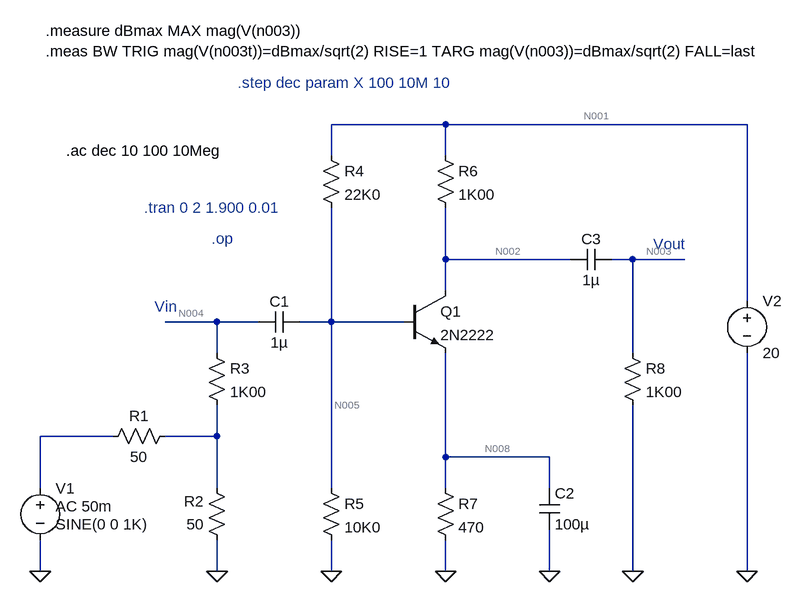
[diagram p0: schematic last ex.asc]
last ex.asc, the LTspice schematic file:
Version 4
SHEET 1 1496 680
WIRE 672 -464 496 -464
WIRE 1136 -464 672 -464
WIRE 496 -416 496 -464
WIRE 672 -416 672 -464
WIRE 672 -256 672 -336
WIRE 864 -256 672 -256
WIRE 960 -256 928 -256
WIRE 1040 -256 960 -256
WIRE 672 -208 672 -256
WIRE 1136 -192 1136 -464
WIRE 320 -160 240 -160
WIRE 384 -160 320 -160
WIRE 496 -160 496 -336
WIRE 496 -160 448 -160
WIRE 608 -160 496 -160
WIRE 320 -112 320 -160
WIRE 960 -112 960 -256
WIRE 160 16 48 16
WIRE 320 16 320 -32
WIRE 320 16 240 16
WIRE 672 48 672 -112
WIRE 832 48 672 48
WIRE 48 96 48 16
WIRE 320 96 320 16
WIRE 496 96 496 -160
WIRE 672 96 672 48
WIRE 832 96 832 48
WIRE 48 224 48 176
WIRE 320 224 320 176
WIRE 496 224 496 176
WIRE 672 224 672 176
WIRE 832 224 832 160
WIRE 960 224 960 -32
WIRE 1136 224 1136 -112
FLAG 48 224 0
FLAG 320 224 0
FLAG 496 224 0
FLAG 672 224 0
FLAG 832 224 0
FLAG 960 224 0
FLAG 1136 224 0
SYMBOL voltage 48 80 R0
WINDOW 123 24 44 Left 2
WINDOW 39 0 0 Left 0
WINDOW 3 24 72 Left 2
SYMATTR Value2 AC 50m
SYMATTR InstName V1
SYMATTR Value SINE(0 0 1K)
SYMBOL res 256 0 R90
WINDOW 0 0 56 VBottom 2
WINDOW 3 32 56 VTop 2
SYMATTR InstName R1
SYMATTR Value 50
SYMBOL res 336 192 R180
WINDOW 0 36 76 Left 2
WINDOW 3 36 40 Left 2
SYMATTR InstName R2
SYMATTR Value 50
SYMBOL res 304 -128 R0
SYMATTR InstName R3
SYMATTR Value 1K00
SYMBOL cap 448 -176 R90
WINDOW 0 0 32 VBottom 2
WINDOW 3 32 32 VTop 2
SYMATTR InstName C1
SYMATTR Value 1µ
SYMBOL res 480 -432 R0
SYMATTR InstName R4
SYMATTR Value 22K0
SYMBOL res 480 80 R0
SYMATTR InstName R5
SYMATTR Value 10K0
SYMBOL res 656 -432 R0
SYMATTR InstName R6
SYMATTR Value 1K00
SYMBOL npn 608 -208 R0
SYMATTR InstName Q1
SYMATTR Value 2N2222
SYMBOL res 656 80 R0
SYMATTR InstName R7
SYMATTR Value 470
SYMBOL cap 816 96 R0
SYMATTR InstName C2
SYMATTR Value 100µ
SYMBOL cap 928 -272 R90
WINDOW 0 0 32 VBottom 2
WINDOW 3 32 32 VTop 2
SYMATTR InstName C3
SYMATTR Value 1µ
SYMBOL res 944 -128 R0
SYMATTR InstName R8
SYMATTR Value 1K00
SYMBOL voltage 1136 -208 R0
WINDOW 123 0 0 Left 0
WINDOW 39 0 0 Left 0
SYMATTR InstName V2
SYMATTR Value 20
TEXT 224 -184 Left 2 ;Vin
TEXT 992 -280 Left 2 ;Vout
TEXT 312 -288 Left 2 ;.op
TEXT 208 -336 Left 2 ;.tran 0 2 1.900 0.01
TEXT 352 -528 Left 2 ;.step dec param X 100 10M 10
TEXT 88 -424 Left 2 !.ac dec 10 100 10Meg
TEXT 56 -608 Left 2 !.measure dBmax MAX mag(V(n003))\n.meas BW TRIG mag(V(n003t))=dBmax/sqrt(2) RISE=1 TARG mag(V(n003))=dBmax/sqrt(2) FALL=last

The netlist it stands for:
* last ex.asc
V1 N006 0 SINE(0 0 1K) AC 50m
R1 N007 N006 50
R2 0 N007 50
R3 N004 N007 1K00
C1 N005 N004 1µ
R4 N001 N005 22K0
R5 N005 0 10K0
R6 N001 N002 1K00
Q1 N002 N005 N008 0 2N2222
R7 N008 0 470
C2 N008 0 100µ
C3 N003 N002 1µ
R8 N003 0 1K00
V2 N001 0 20
.model NPN NPN
.model PNP PNP
.lib standard.bjt
* Vin
* Vout
* .op
* .tran 0 2 1.900 0.01
* .step dec param X 100 10M 10
.ac dec 10 100 10Meg
.measure dBmax MAX mag(V(n003))
.meas BW TRIG mag(V(n003t))=dBmax/sqrt(2) RISE=1 TARG mag(V(n003))=dBmax/sqrt(2) FALL=last
.backanno
.end

* Results of the author's LTspice run, read from the files saved beside the schematic
* Operating Point, zero values left out:
*   V(n005) = 5.874 V
*   V(n001) = 20 V
*   V(n002) = 9.089 V
*   V(n008) = 5.154 V
*   Ic(Q1) = 10.91 mA
*   Ib(Q1) = 54.72 µA
*   Ie(Q1) = -10.97 mA
*   I(R4) = 642.1 µA
*   I(R5) = 587.4 µA
*   I(R6) = 10.91 mA
*   I(R7) = 10.97 mA
*   I(V2) = -11.55 mA
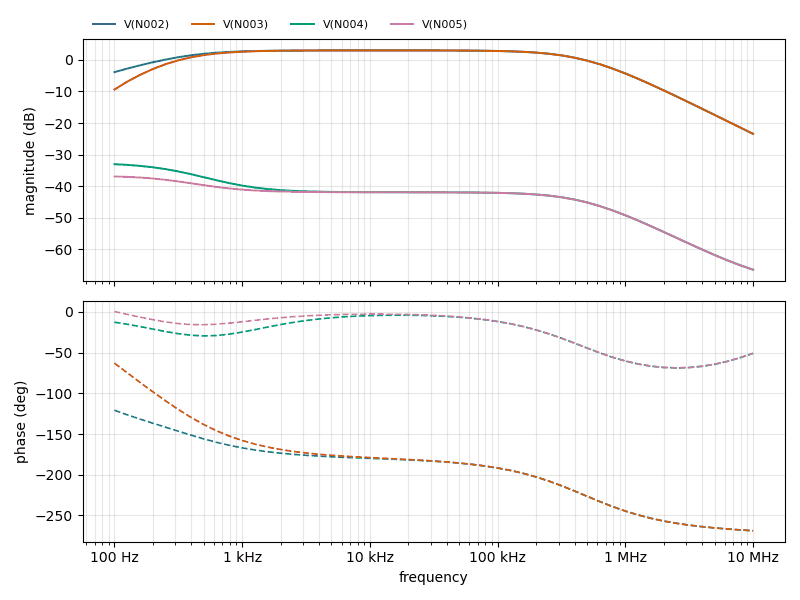
[diagram p1: AC Analysis of last ex.asc, plotted from the saved traces]
* AC Analysis, 1 run:
*   V(N002): -3.90 dB at 100 Hz, -23.43 dB at 10 MHz, peak 2.99 dB at 12.59 kHz, 3 dB below the peak at 244 Hz and 476.4 kHz
*   V(N003): -9.39 dB at 100 Hz, -23.43 dB at 10 MHz, peak 2.99 dB at 12.59 kHz, 3 dB below the peak at 325.7 Hz and 476.5 kHz
*   V(N004): -33.03 dB at 100 Hz, -66.43 dB at 10 MHz, peak -33.03 dB at 100 Hz, 3 dB below the peak at 381.4 Hz
*   V(N005): -36.93 dB at 100 Hz, -66.43 dB at 10 MHz, peak -36.93 dB at 100 Hz, 3 dB below the peak at 556.8 Hz
* From the log:
*   dbmax: MAX(mag(v(n003)))=(2.98708dB,0°) FROM 100 TO 1e+07
*   Measurement "bw" FAIL'ed